# EAGLE schematic 4021 (EAGLE 6.4)
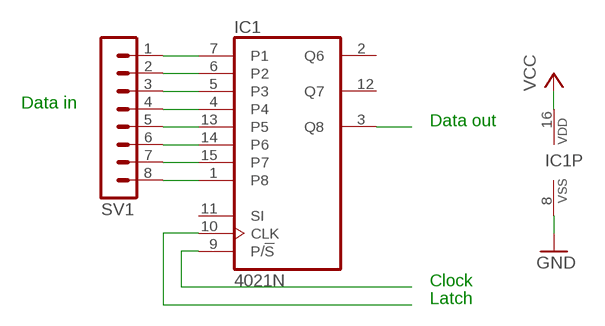
[diagram p0: schematic, sheet 1]

## Parts
IC1  4021N  [DIL16]
SV1  MA08-1  [MA08-1]

## Nets
GND: IC1.8(VSS)
N$1: IC1.7(P1) SV1.1
N$2: IC1.6(P2) SV1.2
N$3: IC1.5(P3) SV1.3
N$4: IC1.4 SV1.4
N$5: IC1.13(P5) SV1.5
N$6: IC1.14(P6) SV1.6
N$7: IC1.15(P7) SV1.7
N$8: IC1.1(P8) SV1.8
N$9: IC1.3(Q8)
N$10: IC1.9(P/!S)
N$11: IC1.10(CLK)
VCC: IC1.16(VDD)
Unconnected: IC1.2(Q6) IC1.11(SI) IC1.12(Q7)

## Notes on the sheet
- Data in
- Data out
- Clock
- Latch

## Library data of the parts
IC1 = 40xx:4021: 8-bit static SHIFT REGISTER
SV1 = con-lstb:MA08-1: PIN HEADER; OC_FARNELL: unknown; OC_NEWARK: unknown